# EAGLE design schematic (EAGLE 8.7.0)
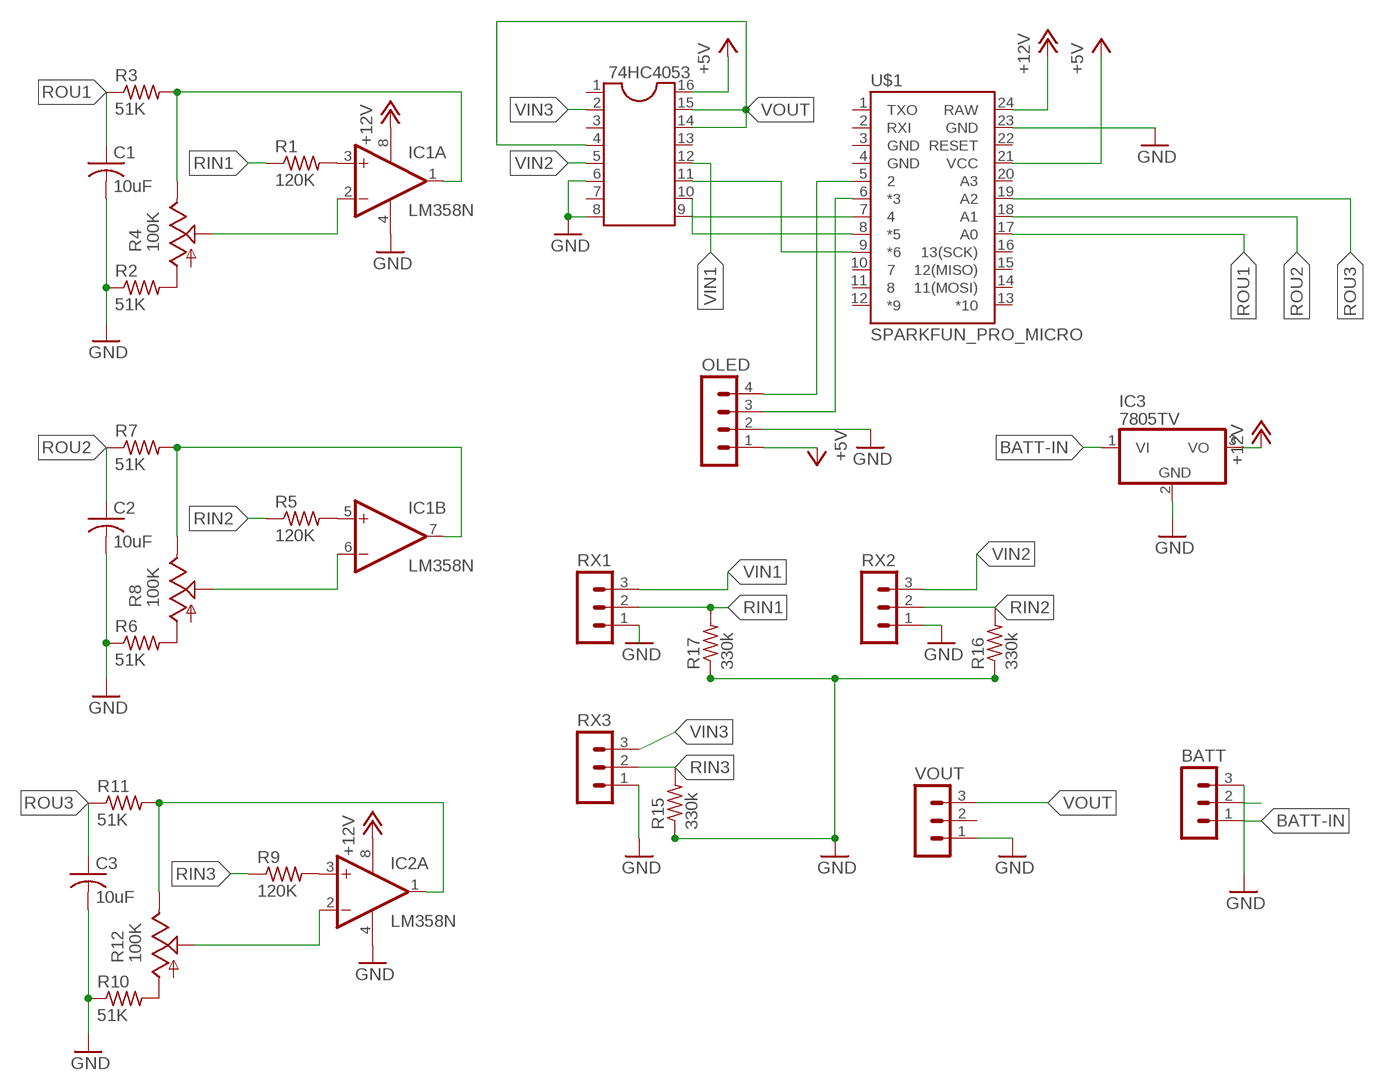
[diagram p0: schematic, sheet 1]

## Parts
74HC4053  DIL16  [DIL16]
BATT  MA03-1  [MA03-1]
C1  10uF  C-US025-025X050  [C025-025X050]
C2  10uF  C-US025-025X050  [C025-025X050]
C3  10uF  C-US025-025X050  [C025-025X050]
IC1  LM358N  [DIL08]
IC2  LM358N  [DIL08]
IC3  7805TV  [TO220V]
OLED  MA04-1  [MA04-1]
R1  120K  R-US_0207/10  [0207/10]
R2  51K  R-US_0207/10  [0207/10]
R3  51K  R-US_0207/10  [0207/10]
R4  100K  TRIM_US-S64W  [S64W]
R5  120K  R-US_0207/10  [0207/10]
R6  51K  R-US_0207/10  [0207/10]
R7  51K  R-US_0207/10  [0207/10]
R8  100K  TRIM_US-S64W  [S64W]
R9  120K  R-US_0207/10  [0207/10]
R10  51K  R-US_0207/10  [0207/10]
R11  51K  R-US_0207/10  [0207/10]
R12  100K  TRIM_US-S64W  [S64W]
R15  330k  R-US_0207/10  [0207/10]
R16  330k  R-US_0207/10  [0207/10]
R17  330k  R-US_0207/10  [0207/10]
RX1  MA03-1  [MA03-1]
RX2  MA03-1  [MA03-1]
RX3  MA03-1  [MA03-1]
U$1  SPARKFUN_PRO_MICRO  [SPARKFUN_PRO_MICRO]
VOUT  MA03-1  [MA03-1]

## Nets
+5V: 74HC4053.16 OLED.1 U$1.21(VCC)
+12V: IC1.8(P:V+) IC2.8(P:V+) IC3.3(VO) U$1.24(RAW)
BATT-IN: BATT.1 IC3.1(VI)
GND: 74HC4053.6 74HC4053.8 BATT.3 C1.2 C2.2 C3.2 IC1.4(P:V-) IC2.4(P:V-) IC3.2(GND) OLED.2 R2.1 R6.1 R10.1 R15.1 R16.1 R17.1 RX1.1 RX2.1 RX3.1 U$1.23(GND) VOUT.1
N$1: 74HC4053.11 U$1.9(*6)
N$2: 74HC4053.10 U$1.8(*5)
N$3: 74HC4053.9 U$1.7
N$4: IC1.3(A:+IN) R1.2
N$5: IC1.1(A:OUT) R3.2 R4.E
N$6: IC1.2(A:-IN) R4.S
N$7: R2.2 R4.A
N$8: OLED.4 U$1.5
N$9: IC1.7(B:OUT) R7.2 R8.E
N$10: R6.2 R8.A
N$11: IC1.6(B:-IN) R8.S
N$12: OLED.3 U$1.6(*3)
N$13: IC2.1(A:OUT) R11.2 R12.E
N$14: R10.2 R12.A
N$15: IC2.2(A:-IN) R12.S
N$17: IC1.5(B:+IN) R5.2
N$18: IC2.3(A:+IN) R9.2
N$20: BATT.2
RIN1: R1.1 R17.2 RX1.2
RIN2: R5.1 R16.2 RX2.2
RIN3: R9.1 R15.2 RX3.2
ROU1: C1.1 R3.1 U$1.17(A0)
ROU2: C2.1 R7.1 U$1.18(A1)
ROU3: C3.1 R11.1 U$1.19(A2)
VIN1: 74HC4053.12 RX1.3
VIN2: 74HC4053.5 RX2.3
VIN3: 74HC4053.2 RX3.3
VOUT: 74HC4053.4 74HC4053.14 74HC4053.15 VOUT.3
Unconnected: 74HC4053.1 74HC4053.3 74HC4053.7 74HC4053.13 IC2.5(B:+IN) IC2.6(B:-IN) IC2.7(B:OUT) U$1.1(TXO) U$1.2(RXI) U$1.10 U$1.11 U$1.12(*9) U$1.13(*10) U$1.14(11(MOSI)) U$1.15(12(MISO)) U$1.16(13(SCK)) U$1.20(A3) U$1.22(RESET) VOUT.2

## Power pins joined to a net without a drawn wire
GND: U$1.3(GND) U$1.4(GND)

## Library data of the parts
74HC4053 = ic-package:DIL16: Dual In Line / Socket
BATT RX1-RX3 VOUT = con-lstb:MA03-1: PIN HEADER; OC_FARNELL: unknown; OC_NEWARK: unknown
C1-C3 = rcl:C-US: CAPACITOR, American symbol
IC1 IC2 = linear:LM358: OP AMP also LM158; LM258; LM2904 Source: http://cache.national.com/ds/LM/LM158.pdf
IC3 = linear:78*: Positive VOLTAGE REGULATOR Source: http://cache.national.com/ds/LM/LM78L05.pdf http://www.fairchildsemi.com/ds/LM/LM7805.pdf
OLED = con-lstb:MA04-1: PIN HEADER; OC_FARNELL: unknown; OC_NEWARK: unknown
R1-R3 R5-R7 R9-R11 R15-R17 = rcl:R-US_: RESISTOR, American symbol
R4 R8 R12 = pot:TRIM_US-: POTENTIOMETER
U$1 = SparkFun-Boards:SPARKFUN_PRO_MICRO: SparkFun Pro Micro Atmega32U4 compatible footprint. SparkFun Products: 3.3V/8MHz <https://www.sparkfun.com/products/12587> 5V/16MHz <https://www.sparkfun.com/products/12640>

## Board
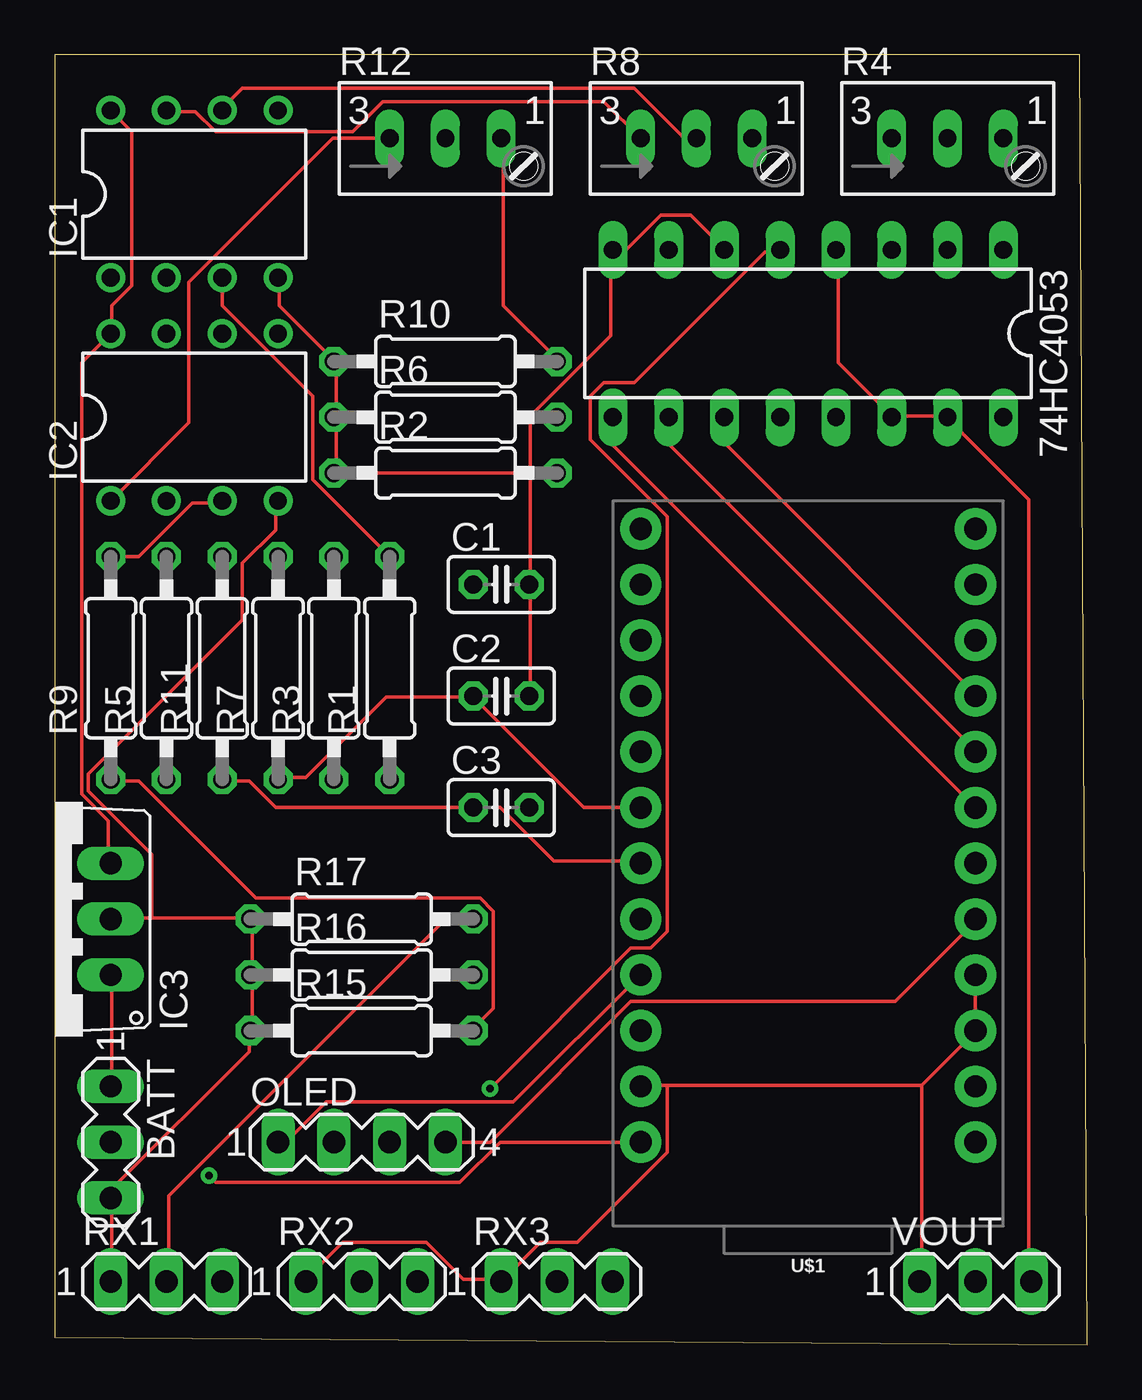
[diagram p1: board, top side]
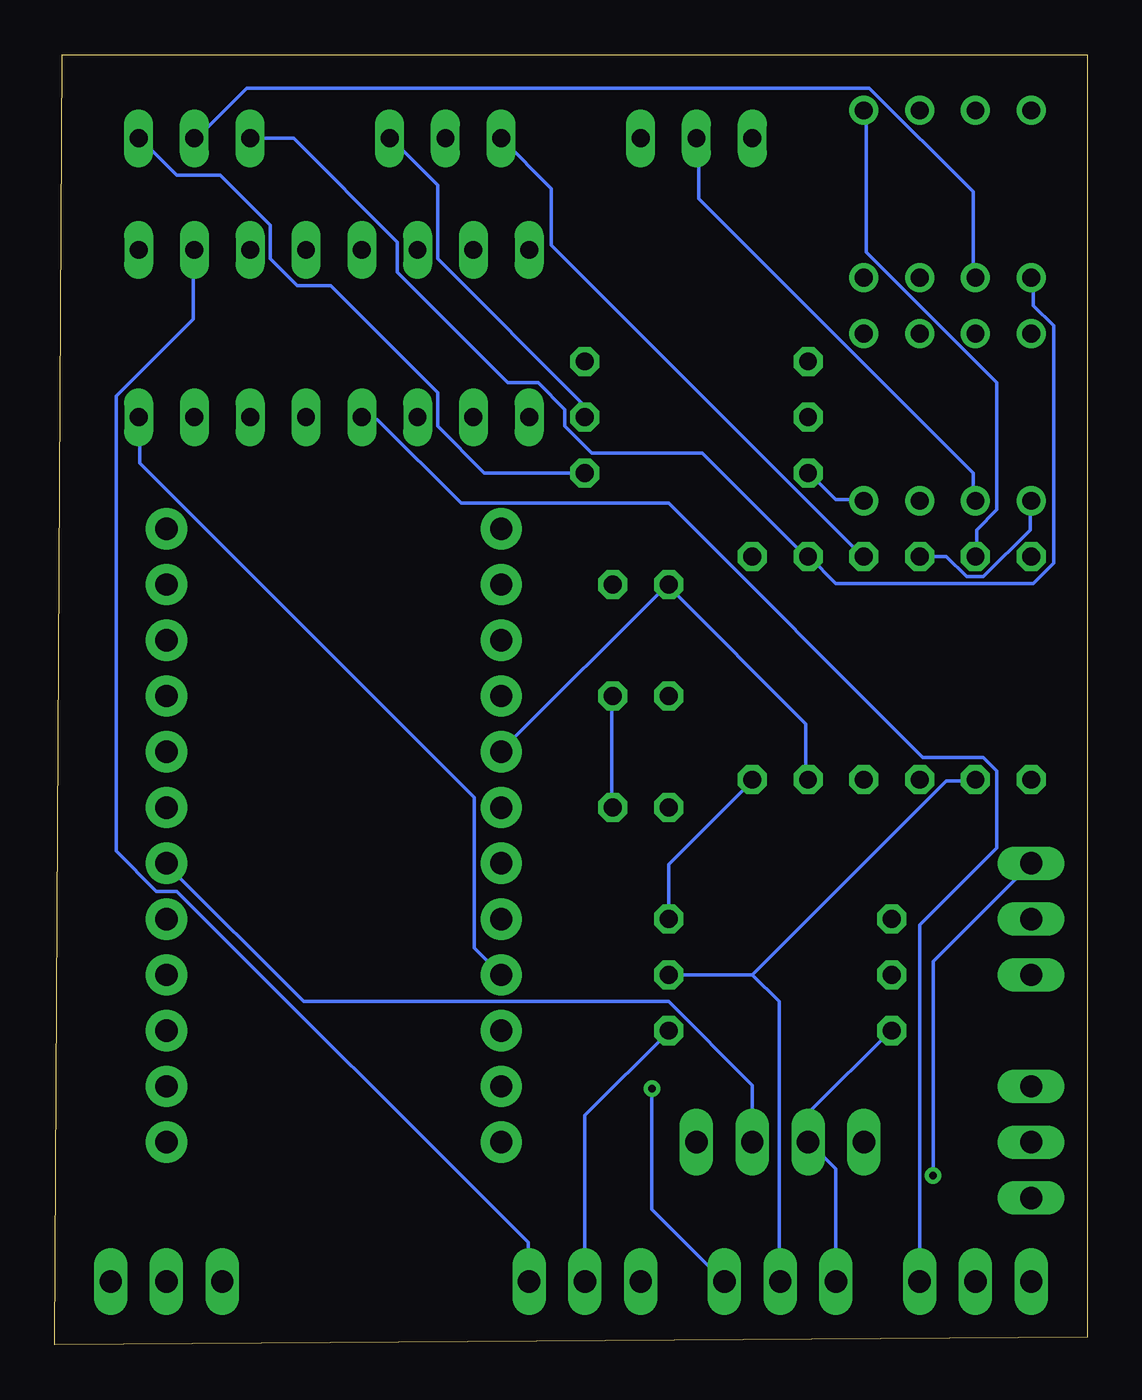
[diagram p2: board, bottom side, seen from below]

Size 46.99 x 58.74 mm. Coordinates in mm from the lower left corner, seen from the top.
Outline: 0,0.33 46.99,0 46.66,58.74 0,58.74 0,0.33
Copper layers (1*16): Top 0.035mm / dielectric 1.5mm / Bottom 0.035mm
Design rules "default": minimum track width 6mil, minimum drill 0.35mm, track to track 6mil, track to pad 6mil, pad to pad 6mil, via to via 6mil, smd to smd 6mil, copper to edge 40mil, drill to drill 6mil, minimum pad ring 10mil, minimum via ring 8mil, stop-mask expansion 4mil, vias tented up to drill 0mil, thermal gap 10mil

### Footprints (pad centres in the part's own frame; a part is rotated, then mirrored left to right if it is on the bottom)
DIL16 = drill 0.813 long: 1 -8.89,-3.81; 2 -6.35,-3.81; 3 -3.81,-3.81; 4 -1.27,-3.81; 5 1.27,-3.81; 6 3.81,-3.81; 7 6.35,-3.81; 8 8.89,-3.81; 9 8.89,3.81; 10 6.35,3.81; 11 3.81,3.81; 12 1.27,3.81; 13 -1.27,3.81; 14 -3.81,3.81; 15 -6.35,3.81; 16 -8.89,3.81
MA03-1 = drill 1.016 long: 1 -2.54,0; 2 0,0; 3 2.54,0
C025-025X050 = drill 0.813 octagon: 1 -1.27,0; 2 1.27,0
DIL08 = drill 0.813 pad 1.27: 1 -3.81,-3.81; 2 -1.27,-3.81; 3 1.27,-3.81; 4 3.81,-3.81; 5 3.81,3.81; 6 1.27,3.81; 7 -1.27,3.81; 8 -3.81,3.81
TO220V = drill 1.016 long: 1 -2.54,-2.54; 2 0,-2.54; 3 2.54,-2.54
MA04-1 = drill 1.016 long: 1 -3.81,0; 2 -1.27,0; 3 1.27,0; 4 3.81,0
0207/10 = drill 0.813 octagon: 1 -5.08,0; 2 5.08,0
S64W = drill 0.813 long: A 2.54,1.27; E -2.54,1.27; S 0,1.27
SPARKFUN_PRO_MICRO = drill 1.016 pad 1.88: 1 -7.62,12.7; 2 -7.62,10.16; 3 -7.62,7.62; 4 -7.62,5.08; 5 -7.62,2.54; 6 -7.62,0; 7 -7.62,-2.54; 8 -7.62,-5.08; 9 -7.62,-7.62; 10 -7.62,-10.16; 11 -7.62,-12.7; 12 -7.62,-15.24; 13 7.62,-15.24; 14 7.62,-12.7; 15 7.62,-10.16; 16 7.62,-7.62; 17 7.62,-5.08; 18 7.62,-2.54; 19 7.62,0; 20 7.62,2.54; 21 7.62,5.08; 22 7.62,7.62; 23 7.62,10.16; 24 7.62,12.7

### Placement (x,y rotation side)
74HC4053  34.29,46.05 180 top
BATT  2.54,9.22 270 top
C1  20.32,34.62 0 top
C2  20.32,29.54 0 top
C3  20.32,24.46 0 top
IC1  6.35,52.4 0 top
IC2  6.35,42.24 0 top
IC3  0,19.38 90 top
OLED  13.97,9.22 0 top
R1  15.24,30.81 90 top
R2  17.78,39.7 0 top
R3  12.7,30.81 90 top
R4  40.64,53.67 0 top
R5  5.08,30.81 90 top
R6  17.78,42.24 0 top
R7  10.16,30.81 90 top
R8  29.21,53.67 0 top
R9  2.54,30.81 90 top
R10  17.78,44.78 0 top
R11  7.62,30.81 90 top
R12  17.78,53.67 0 top
R15  13.97,14.3 0 top
R16  13.97,16.84 0 top
R17  13.97,19.38 0 top
RX1  5.08,2.87 0 top
RX2  13.97,2.87 0 top
RX3  22.86,2.87 0 top
U$1  34.29,21.92 180 top
VOUT  41.91,2.87 0 top

### Tracks (layer width: path | path; a pad name or v marks a point on that pad's centre or on a via)
+5V
  Top 0.152: OLED.1 10.52,9.22 12.34,11.05 20.88,11.05 U$1.21
  Bottom 0.152: U$1.21 27.89,18.06 27.89,24.92 43.13,40.16 43.13,42.14 74HC4053.16
+12V  (via drill 0.35)
  Top 0.152: IC1.8 3.5,55.25 3.5,48.23 2.59,47.32 2.59,46.1 IC2.8 1.22,44.73 1.22,25.07 2.44,23.85 2.44,22.02 IC3.3 | U$1.24 20.27,9.22 18.44,7.39 7.32,7.39 v7.01,7.7
  Bottom 0.152: v7.01,7.7 7.01,17.45 IC3.3
BATT-IN
  Top 0.152: BATT.1 2.59,11.81 2.59,16.84 IC3.1
GND
  Top 0.152: IC1.4 10.21,48.54 10.21,47.32 12.65,44.88 R10.1 12.8,44.73 12.8,42.29 R6.1 12.8,42.14 12.8,39.7 | 74HC4053.6 30.48,49.91 28.96,51.44 27.58,51.44 26.06,49.91 25.45,49.91 74HC4053.8 25.3,49.76 25.3,45.95 21.64,42.29 21.64,39.7 | C2.2 21.64,29.64 21.64,34.52 C1.2 21.64,34.67 21.64,39.7 | 21.64,39.7 12.8,39.7 | 12.8,39.7 R2.1 | 39.47,11.81 39.47,2.97 VOUT.1 | 39.47,11.81 41.91,14.25 U$1.3 U$1.4 | 39.47,11.81 27.89,11.81 | 27.89,11.81 26.67,11.81 U$1.23 | RX2.1 11.43,2.97 13.11,4.65 16.92,4.65 18.59,2.97 20.27,2.97 RX3.1 22.1,4.65 23.77,4.65 27.89,8.76 27.89,11.81 | RX1.1 2.59,2.97 2.59,6.63 BATT.3 2.59,6.78 2.59,7.09 8.84,13.33 8.84,14.25 R15.1 8.99,14.4 8.99,16.84 | 8.99,16.84 8.99,19.28 R17.1 8.84,19.43 4.42,19.43 | 8.99,16.84 R16.1 | 4.42,19.43 2.59,19.43 IC3.2 | 4.42,19.43 4.42,22.33 1.52,25.22 1.52,25.98 8.53,32.99 8.53,35.59 10.06,37.11 10.06,38.33 IC2.4
  Bottom 0.152: IC2.4 10.21,38.48 11.43,38.48 12.65,39.7 R2.1 | C3.2 21.64,24.46 21.64,29.49 C2.2 | RX2.1 11.43,8 12.65,9.22 | 12.65,9.22 12.65,10.59 8.99,14.25 R15.1 | 12.65,9.22 OLED.2
N$1
  Top 0.152: 74HC4053.11 30.48,41.07 41.91,29.64 U$1.9
N$2
  Top 0.152: 74HC4053.10 28.04,42.14 28.04,40.92 41.91,27.05 U$1.8
N$3
  Top 0.152: U$1.7 25.45,40.92 25.45,42.14 74HC4053.9
N$4
  Top 0.152: IC1.3 7.62,47.32 11.73,43.2 11.73,39.4 R1.2
N$5
  Bottom 0.152: 38.1,56.16 R4.E 36.12,54.94 31.39,50.22 31.39,48.84 26.36,43.82 24.99,43.82 23.77,42.6 23.77,41.83 22.55,40.61 17.53,40.61 12.8,35.89 R3.2 12.65,35.89 11.43,34.67 2.44,34.67 1.52,35.59 1.52,46.41 2.44,47.32 2.44,48.54 IC1.1
N$6
  Bottom 0.152: IC1.2 5.18,48.69 5.18,52.5 9.91,57.23 38.25,57.23 40.54,54.94 R4.S
N$7
  Bottom 0.152: R2.2 27.43,39.7 29.57,41.83 29.57,43.36 34.44,48.23 35.97,48.23 37.19,49.45 37.19,50.98 39.47,53.26 41.45,53.26 43.13,54.94 R4.A
N$8
  Top 0.152: OLED.4 19.81,9.22 26.21,15.62 38.25,15.62 41.91,19.28 U$1.5
N$9
  Top 0.152: R8.E 24.99,56.62 14.94,56.62 13.56,55.25 7.32,55.25 6.4,56.16 5.18,56.16 IC1.7
  Bottom 0.152: R8.E 24.38,52.65 24.38,50.06 10.21,35.89 R7.2
N$10
  Bottom 0.152: R6.2 22.86,42.75 29.57,49.45 29.57,52.81 31.7,54.94 R8.A
N$11
  Top 0.152: R8.S 28.65,54.94 26.36,57.23 8.53,57.23 7.62,56.31 IC1.6
N$12
  Bottom 0.152: OLED.3 15.24,11.81 19.05,15.62 35.66,15.62 41.91,21.87 U$1.6
N$13
  Top 0.152: R12.E 12.65,54.94 6.1,48.39 6.1,41.99 IC2.1
  Bottom 0.152: R11.2 6.4,35.89 5.49,34.98 4.72,34.98 2.59,37.11 2.59,38.33 IC2.1
N$14
  Top 0.152: R12.A 20.42,54.94 20.42,47.32 22.86,44.88 R10.2
N$15
  Bottom 0.152: IC2.2 5.18,38.48 5.18,39.7 17.68,52.2 17.68,54.94 R12.S
N$17
  Bottom 0.152: R5.2 5.03,35.89 5.03,37.11 4.12,38.02 4.12,43.82 10.06,49.76 10.06,56.16 IC1.5
N$18
  Top 0.152: R9.2 3.81,35.89 6.25,38.33 7.62,38.33 IC2.3
RIN1
  Top 0.152: RX1.2 5.18,2.97 5.18,6.78 17.68,19.28 19.05,19.28 R17.2
  Bottom 0.152: R17.2 19.05,21.87 15.24,25.68 R1.1
RIN2
  Bottom 0.152: 15.24,16.84 6.4,25.68 5.18,25.68 R5.1 | R16.2 15.24,16.84 | 15.24,16.84 14.02,15.62 14.02,2.97 RX2.2
RIN3
  Top 0.152: R9.1 2.59,25.68 3.81,25.68 9.14,20.35 19.36,20.35 19.96,19.74 19.96,15.32 19.05,14.4 R15.2
  Bottom 0.152: RX3.2 22.86,10.44 19.05,14.25 R15.2
ROU1
  Bottom 0.152: R3.1 12.8,25.83 12.8,28.27 19.05,34.52 C1.1 19.05,34.67 26.67,27.05 U$1.17
ROU2
  Top 0.152: 19.05,29.49 15.09,29.49 11.43,25.83 10.21,25.83 R7.1 | U$1.18 24.08,24.46 19.05,29.49 | 19.05,29.49 C2.1
ROU3
  Top 0.152: U$1.19 26.67,22.02 22.71,22.02 20.27,24.46 C3.1 10.06,24.46 8.84,25.68 7.62,25.68 R11.1
VIN1
  Bottom 0.152: RX1.3 7.62,19.13 4.12,22.63 4.12,26.14 4.72,26.75 7.47,26.75 19.05,38.33 28.5,38.33 32.31,42.14 32.92,42.14 74HC4053.12
VIN2  (via drill 0.35)
  Top 0.152: v19.81,11.66 26.21,18.06 27.13,18.06 27.89,18.82 27.89,37.72 24.38,41.22 24.38,43.2 24.99,43.82 26.36,43.82 32.31,49.76 32.92,49.76 74HC4053.5
  Bottom 0.152: v19.81,11.66 19.81,6.17 RX2.3
VIN3
  Bottom 0.152: 74HC4053.2 40.69,49.76 40.69,46.71 44.2,43.2 44.2,22.48 42.37,20.65 41.45,20.65 25.45,4.65 25.45,2.97 RX3.3
VOUT
  Top 0.152: 38.1,42.29 40.54,42.29 74HC4053.15 40.69,42.14 44.35,38.48 44.35,2.97 VOUT.3 | 38.1,42.29 35.66,44.73 35.66,49.76 74HC4053.4 | 38.1,42.29 74HC4053.14